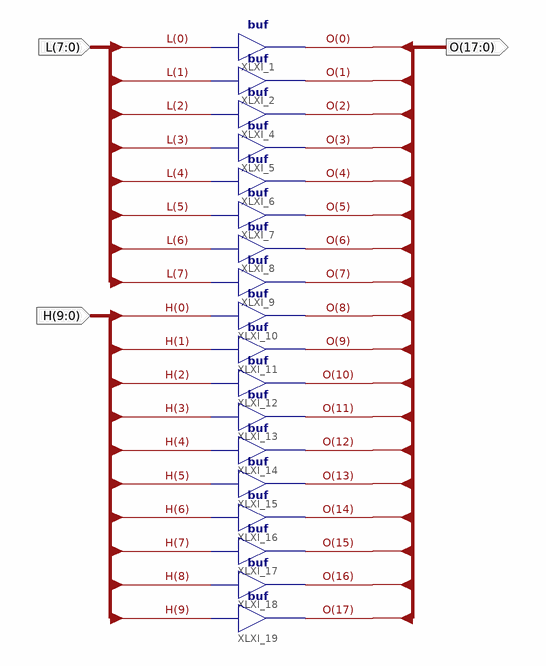
[diagram p0: schematic sheet 1]
// Xilinx ISE schematic splice8x10x18.sch (spartan6) as structural Verilog: 18 symbols, 3 ports
module splice8x10x18 (
  input  [7:0] L,
  input  [9:0] H,
  output [17:0] O
);

  buf XLXI_1 (O[0], L[0]);
  buf XLXI_2 (O[1], L[1]);
  buf XLXI_4 (O[2], L[2]);
  buf XLXI_5 (O[3], L[3]);
  buf XLXI_6 (O[4], L[4]);
  buf XLXI_7 (O[5], L[5]);
  buf XLXI_8 (O[6], L[6]);
  buf XLXI_9 (O[7], L[7]);
  buf XLXI_10 (O[8], H[0]);
  buf XLXI_11 (O[9], H[1]);
  buf XLXI_12 (O[10], H[2]);
  buf XLXI_13 (O[11], H[3]);
  buf XLXI_14 (O[12], H[4]);
  buf XLXI_15 (O[13], H[5]);
  buf XLXI_16 (O[14], H[6]);
  buf XLXI_17 (O[15], H[7]);
  buf XLXI_18 (O[16], H[8]);
  buf XLXI_19 (O[17], H[9]);
endmodule
